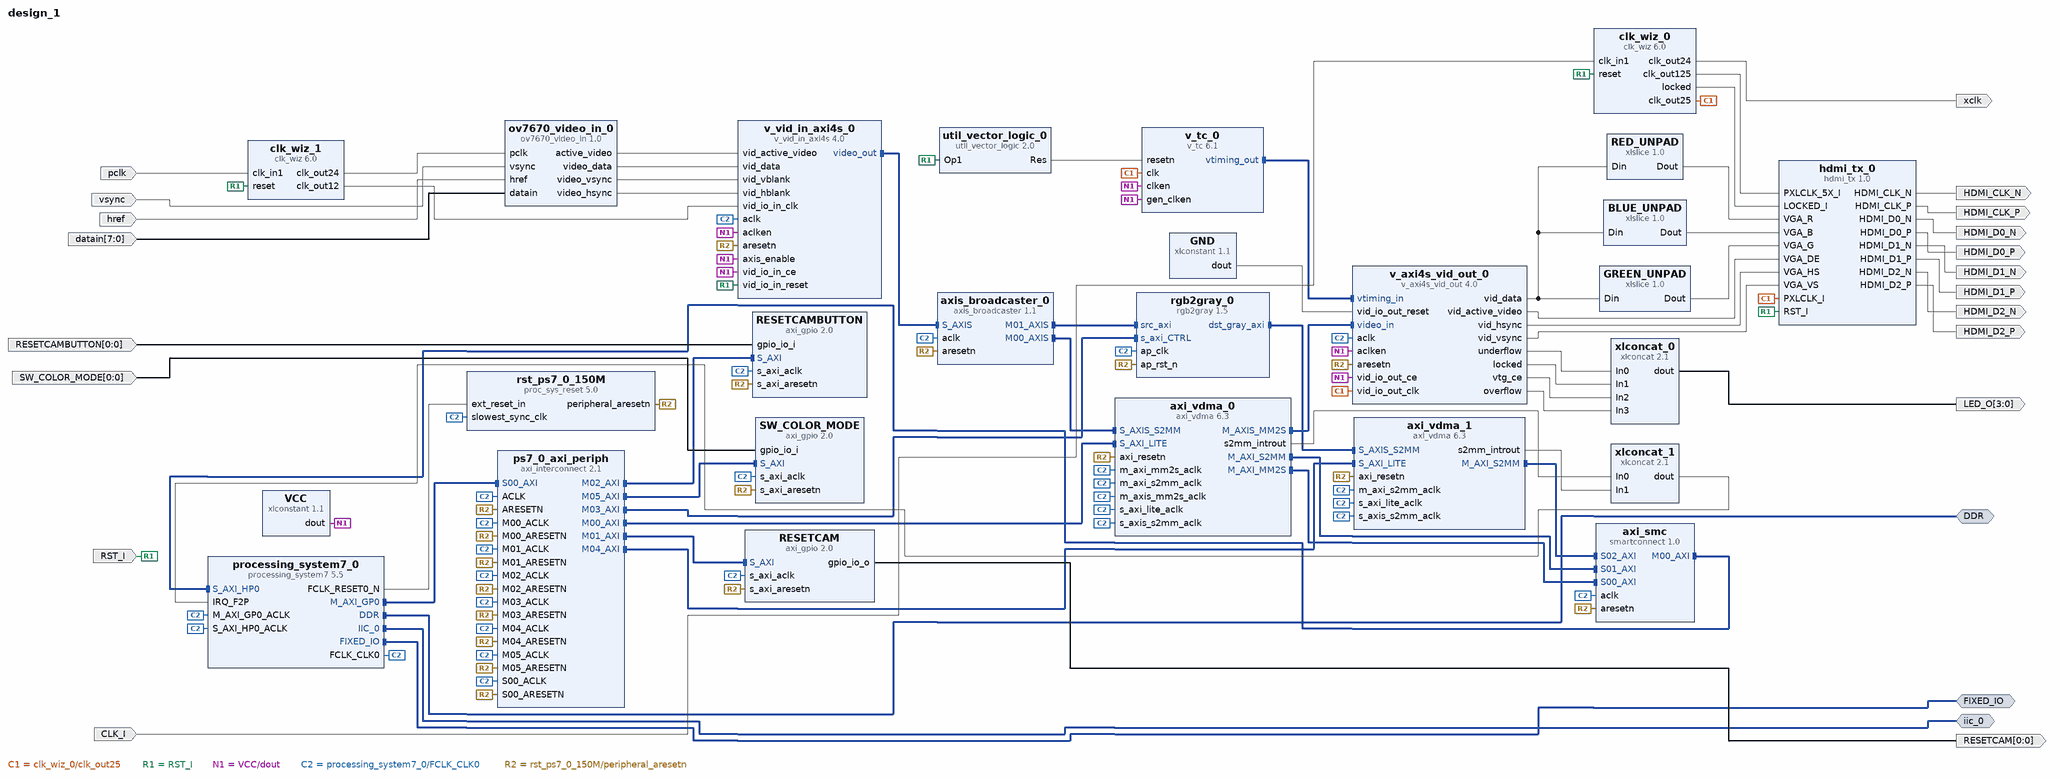
[diagram p0: block diagram of the top level]
# Vivado block design design_1, xc7z010clg400-1, Vivado 2019.1
create_bd_design design_1

create_bd_intf_port -mode Master -vlnv xilinx.com:interface:ddrx_rtl:1.0 DDR
create_bd_intf_port -mode Master -vlnv xilinx.com:display_processing_system7:fixedio_rtl:1.0 FIXED_IO
create_bd_intf_port -mode Master -vlnv xilinx.com:interface:iic_rtl:1.0 iic_0
create_bd_port -dir I -type clk CLK_I
set_property -dict {CONFIG.FREQ_HZ 125000000} [get_bd_ports CLK_I]
create_bd_port -dir I -type rst RST_I
set_property -dict {CONFIG.POLARITY ACTIVE_HIGH} [get_bd_ports RST_I]
create_bd_port -dir O HDMI_CLK_N
create_bd_port -dir O HDMI_D2_N
create_bd_port -dir O HDMI_D0_N
create_bd_port -dir O HDMI_D2_P
create_bd_port -dir O HDMI_D1_N
create_bd_port -dir O HDMI_D0_P
create_bd_port -dir O HDMI_D1_P
create_bd_port -dir O HDMI_CLK_P
create_bd_port -dir I vsync
create_bd_port -dir I href
create_bd_port -dir I -from 7 -to 0 datain
create_bd_port -dir I -type clk pclk
set_property -dict {CONFIG.FREQ_HZ 24000000} [get_bd_ports pclk]
create_bd_port -dir O -from 3 -to 0 LED_O
create_bd_port -dir O -type clk xclk
set_property -dict {CONFIG.FREQ_HZ 24038461} [get_bd_ports xclk]
create_bd_port -dir O -from 0 -to 0 RESETCAM
create_bd_port -dir I -from 0 -to 0 RESETCAMBUTTON
create_bd_port -dir I -from 0 -to 0 SW_COLOR_MODE

create_bd_cell -type ip -vlnv xilinx.com:ip:processing_system7:5.5 processing_system7_0
set_property -dict [list \
  CONFIG.PCW_APU_PERIPHERAL_FREQMHZ 666.666666 \
  CONFIG.PCW_ENET0_ENET0_IO {MIO 16 .. 27} \
  CONFIG.PCW_ENET0_GRP_MDIO_ENABLE 1 \
  CONFIG.PCW_ENET0_GRP_MDIO_IO {MIO 52 .. 53} \
  CONFIG.PCW_ENET0_PERIPHERAL_ENABLE 1 \
  CONFIG.PCW_ENET0_RESET_ENABLE 0 \
  CONFIG.PCW_ENET_RESET_ENABLE 1 \
  CONFIG.PCW_ENET_RESET_SELECT {Share reset pin} \
  CONFIG.PCW_FPGA0_PERIPHERAL_FREQMHZ 150 \
  CONFIG.PCW_GPIO_MIO_GPIO_ENABLE 1 \
  CONFIG.PCW_GPIO_MIO_GPIO_IO MIO \
  CONFIG.PCW_I2C0_I2C0_IO EMIO \
  CONFIG.PCW_I2C0_PERIPHERAL_ENABLE 1 \
  CONFIG.PCW_I2C_PERIPHERAL_FREQMHZ 111.111115 \
  CONFIG.PCW_I2C_RESET_ENABLE 1 \
  CONFIG.PCW_I2C_RESET_SELECT {Share reset pin} \
  CONFIG.PCW_IRQ_F2P_INTR 1 \
  CONFIG.PCW_PRESET_BANK1_VOLTAGE {LVCMOS 1.8V} \
  CONFIG.PCW_QSPI_GRP_FBCLK_ENABLE 1 \
  CONFIG.PCW_QSPI_GRP_FBCLK_IO {MIO 8} \
  CONFIG.PCW_QSPI_GRP_SINGLE_SS_ENABLE 1 \
  CONFIG.PCW_QSPI_GRP_SINGLE_SS_IO {MIO 1 .. 6} \
  CONFIG.PCW_QSPI_PERIPHERAL_ENABLE 1 \
  CONFIG.PCW_QSPI_QSPI_IO {MIO 1 .. 6} \
  CONFIG.PCW_SD0_GRP_CD_ENABLE 0 \
  CONFIG.PCW_SD0_GRP_WP_ENABLE 0 \
  CONFIG.PCW_SD0_PERIPHERAL_ENABLE 1 \
  CONFIG.PCW_SD0_SD0_IO {MIO 40 .. 45} \
  CONFIG.PCW_SDIO_PERIPHERAL_FREQMHZ 50 \
  CONFIG.PCW_SINGLE_QSPI_DATA_MODE x4 \
  CONFIG.PCW_UART1_PERIPHERAL_ENABLE 1 \
  CONFIG.PCW_UART1_UART1_IO {MIO 48 .. 49} \
  CONFIG.PCW_UART_PERIPHERAL_FREQMHZ 100 \
  CONFIG.PCW_UIPARAM_DDR_FREQ_MHZ 533.333333 \
  CONFIG.PCW_UIPARAM_DDR_MEMORY_TYPE {DDR 3 (Low Voltage)} \
  CONFIG.PCW_UIPARAM_DDR_PARTNO {MT41K256M16 RE-125} \
  CONFIG.PCW_USB0_PERIPHERAL_ENABLE 0 \
  CONFIG.PCW_USB_RESET_ENABLE 1 \
  CONFIG.PCW_USE_FABRIC_INTERRUPT 1 \
  CONFIG.PCW_USE_S_AXI_HP0 1 \
] [get_bd_cells processing_system7_0]
# 300 more settings of processing_system7_0 are not shown: defaults, MIO pin electricals, DDR timing, and values the tool derives
create_bd_cell -type ip -vlnv xilinx.com:ip:clk_wiz:6.0 clk_wiz_0
set_property -dict [list \
  CONFIG.CLKIN1_JITTER_PS 80.0 \
  CONFIG.CLKOUT1_JITTER 130.680 \
  CONFIG.CLKOUT1_PHASE_ERROR 122.096 \
  CONFIG.CLKOUT1_REQUESTED_OUT_FREQ 125 \
  CONFIG.CLKOUT2_JITTER 181.315 \
  CONFIG.CLKOUT2_PHASE_ERROR 122.096 \
  CONFIG.CLKOUT2_REQUESTED_OUT_FREQ 25 \
  CONFIG.CLKOUT2_USED true \
  CONFIG.CLKOUT3_JITTER 182.746 \
  CONFIG.CLKOUT3_PHASE_ERROR 122.096 \
  CONFIG.CLKOUT3_REQUESTED_OUT_FREQ 24 \
  CONFIG.CLKOUT3_USED true \
  CONFIG.CLK_OUT1_PORT clk_out125 \
  CONFIG.CLK_OUT2_PORT clk_out25 \
  CONFIG.CLK_OUT3_PORT clk_out24 \
  CONFIG.MMCM_CLKFBOUT_MULT_F 5.000 \
  CONFIG.MMCM_CLKIN1_PERIOD 8.000 \
  CONFIG.MMCM_CLKIN2_PERIOD 10.0 \
  CONFIG.MMCM_CLKOUT0_DIVIDE_F 5.000 \
  CONFIG.MMCM_CLKOUT1_DIVIDE 25 \
  CONFIG.MMCM_CLKOUT2_DIVIDE 26 \
  CONFIG.NUM_OUT_CLKS 3 \
  CONFIG.PRIM_IN_FREQ 125 \
] [get_bd_cells clk_wiz_0]
create_bd_cell -type ip -vlnv xilinx.com:ip:util_vector_logic:2.0 util_vector_logic_0
set_property -dict {CONFIG.C_OPERATION not CONFIG.C_SIZE 1} [get_bd_cells util_vector_logic_0]
create_bd_cell -type ip -vlnv digilentinc.com:digilent:hdmi_tx:1.0 hdmi_tx_0
set_property -dict {CONFIG.C_BLUE_WIDTH 5 CONFIG.C_GREEN_WIDTH 6 CONFIG.C_RED_WIDTH 5} [get_bd_cells hdmi_tx_0]
create_bd_cell -type ip -vlnv xilinx.com:ip:v_axi4s_vid_out:4.0 v_axi4s_vid_out_0
set_property -dict {CONFIG.C_ADDR_WIDTH 12 CONFIG.C_HAS_ASYNC_CLK 1 CONFIG.C_VTG_MASTER_SLAVE 1} [get_bd_cells v_axi4s_vid_out_0]
create_bd_cell -type ip -vlnv xilinx.com:ip:xlslice:1.0 GREEN_UNPAD
set_property -dict {CONFIG.DIN_FROM 15 CONFIG.DIN_TO 10 CONFIG.DIN_WIDTH 24 CONFIG.DOUT_WIDTH 6} [get_bd_cells GREEN_UNPAD]
create_bd_cell -type ip -vlnv xilinx.com:ip:xlslice:1.0 RED_UNPAD
set_property -dict {CONFIG.DIN_FROM 23 CONFIG.DIN_TO 19 CONFIG.DIN_WIDTH 24 CONFIG.DOUT_WIDTH 5} [get_bd_cells RED_UNPAD]
create_bd_cell -type ip -vlnv xilinx.com:ip:xlslice:1.0 BLUE_UNPAD
set_property -dict {CONFIG.DIN_FROM 7 CONFIG.DIN_TO 3 CONFIG.DIN_WIDTH 24 CONFIG.DOUT_WIDTH 5} [get_bd_cells BLUE_UNPAD]
create_bd_cell -type ip -vlnv xilinx.com:ip:v_tc:6.1 v_tc_0
set_property -dict {CONFIG.HAS_AXI4_LITE false CONFIG.VIDEO_MODE 640x480p CONFIG.enable_detection false} [get_bd_cells v_tc_0]
create_bd_cell -type ip -vlnv xilinx.com:ip:xlconstant:1.1 GND
set_property -dict {CONFIG.CONST_VAL 0} [get_bd_cells GND]
create_bd_cell -type ip -vlnv xilinx.com:ip:xlconstant:1.1 VCC
create_bd_cell -type ip -vlnv xilinx.com:ip:axi_vdma:6.3 axi_vdma_0
set_property -dict {CONFIG.c_m_axis_mm2s_tdata_width 24 CONFIG.c_num_fstores 4} [get_bd_cells axi_vdma_0]
create_bd_cell -type ip -vlnv xilinx.com:ip:axi_interconnect:2.1 ps7_0_axi_periph
set_property -dict {CONFIG.NUM_MI 6} [get_bd_cells ps7_0_axi_periph]
create_bd_cell -type ip -vlnv xilinx.com:ip:proc_sys_reset:5.0 rst_ps7_0_150M
create_bd_cell -type ip -vlnv xilinx.com:ip:smartconnect:1.0 axi_smc
set_property -dict {CONFIG.NUM_SI 3} [get_bd_cells axi_smc]
create_bd_cell -type ip -vlnv xilinx.com:ip:v_vid_in_axi4s:4.0 v_vid_in_axi4s_0
set_property -dict {CONFIG.C_HAS_ASYNC_CLK 1} [get_bd_cells v_vid_in_axi4s_0]
create_bd_cell -type ip -vlnv xilinx.com:user:ov7670_video_in:1.0 ov7670_video_in_0
create_bd_cell -type ip -vlnv xilinx.com:ip:clk_wiz:6.0 clk_wiz_1
set_property -dict [list \
  CONFIG.CLKIN1_JITTER_PS 416.65999999999997 \
  CONFIG.CLKOUT1_JITTER 367.252 \
  CONFIG.CLKOUT1_PHASE_ERROR 244.470 \
  CONFIG.CLKOUT1_REQUESTED_OUT_FREQ 24 \
  CONFIG.CLKOUT2_JITTER 421.167 \
  CONFIG.CLKOUT2_PHASE_ERROR 244.470 \
  CONFIG.CLKOUT2_REQUESTED_OUT_FREQ 12 \
  CONFIG.CLKOUT2_USED true \
  CONFIG.CLK_OUT1_PORT clk_out24 \
  CONFIG.CLK_OUT2_PORT clk_out12 \
  CONFIG.MMCM_CLKFBOUT_MULT_F 41.500 \
  CONFIG.MMCM_CLKIN1_PERIOD 41.667 \
  CONFIG.MMCM_CLKIN2_PERIOD 10.0 \
  CONFIG.MMCM_CLKOUT0_DIVIDE_F 41.500 \
  CONFIG.MMCM_CLKOUT1_DIVIDE 83 \
  CONFIG.NUM_OUT_CLKS 2 \
  CONFIG.PRIM_IN_FREQ 24 \
] [get_bd_cells clk_wiz_1]
create_bd_cell -type ip -vlnv xilinx.com:ip:xlconcat:2.1 xlconcat_0
set_property -dict {CONFIG.NUM_PORTS 4} [get_bd_cells xlconcat_0]
create_bd_cell -type ip -vlnv xilinx.com:ip:axi_gpio:2.0 RESETCAM
set_property -dict {CONFIG.C_ALL_OUTPUTS 1 CONFIG.C_GPIO_WIDTH 1} [get_bd_cells RESETCAM]
create_bd_cell -type ip -vlnv xilinx.com:ip:axi_gpio:2.0 RESETCAMBUTTON
set_property -dict {CONFIG.C_ALL_INPUTS 1 CONFIG.C_GPIO_WIDTH 1} [get_bd_cells RESETCAMBUTTON]
create_bd_cell -type ip -vlnv xilinx.com:ip:axi_vdma:6.3 axi_vdma_1
set_property -dict {CONFIG.c_include_mm2s 0} [get_bd_cells axi_vdma_1]
create_bd_cell -type ip -vlnv xilinx.com:ip:xlconcat:2.1 xlconcat_1
create_bd_cell -type ip -vlnv xilinx.com:ip:axi_gpio:2.0 SW_COLOR_MODE
set_property -dict {CONFIG.C_ALL_INPUTS 1 CONFIG.C_GPIO_WIDTH 1} [get_bd_cells SW_COLOR_MODE]
create_bd_cell -type ip -vlnv xilinx.com:hls:rgb2gray:1.5 rgb2gray_0
create_bd_cell -type ip -vlnv xilinx.com:ip:axis_broadcaster:1.1 axis_broadcaster_0

# ---- connections ----

connect_bd_intf_net [get_bd_intf_pins axi_smc/M00_AXI] [get_bd_intf_pins processing_system7_0/S_AXI_HP0]
connect_bd_intf_net [get_bd_intf_pins ps7_0_axi_periph/M04_AXI] [get_bd_intf_pins axi_vdma_1/S_AXI_LITE]
connect_bd_intf_net [get_bd_intf_pins processing_system7_0/M_AXI_GP0] [get_bd_intf_pins ps7_0_axi_periph/S00_AXI]
connect_bd_intf_net [get_bd_intf_pins axi_vdma_0/M_AXI_S2MM] [get_bd_intf_pins axi_smc/S01_AXI]
connect_bd_intf_net [get_bd_intf_pins rgb2gray_0/dst_gray_axi] [get_bd_intf_pins axi_vdma_1/S_AXIS_S2MM]
connect_bd_intf_net [get_bd_intf_pins axis_broadcaster_0/M00_AXIS] [get_bd_intf_pins axi_vdma_0/S_AXIS_S2MM]
connect_bd_intf_net [get_bd_intf_pins ps7_0_axi_periph/M03_AXI] [get_bd_intf_pins rgb2gray_0/s_axi_CTRL]
connect_bd_intf_net [get_bd_intf_pins axis_broadcaster_0/M01_AXIS] [get_bd_intf_pins rgb2gray_0/src_axi]
connect_bd_intf_net [get_bd_intf_pins ps7_0_axi_periph/M02_AXI] [get_bd_intf_pins RESETCAMBUTTON/S_AXI]
connect_bd_intf_net [get_bd_intf_pins ps7_0_axi_periph/M05_AXI] [get_bd_intf_pins SW_COLOR_MODE/S_AXI]
connect_bd_intf_net [get_bd_intf_ports iic_0] [get_bd_intf_pins processing_system7_0/IIC_0]
connect_bd_intf_net [get_bd_intf_pins v_tc_0/vtiming_out] [get_bd_intf_pins v_axi4s_vid_out_0/vtiming_in]
connect_bd_intf_net [get_bd_intf_pins v_vid_in_axi4s_0/video_out] [get_bd_intf_pins axis_broadcaster_0/S_AXIS]
connect_bd_intf_net [get_bd_intf_pins axi_vdma_1/M_AXI_S2MM] [get_bd_intf_pins axi_smc/S02_AXI]
connect_bd_intf_net [get_bd_intf_ports DDR] [get_bd_intf_pins processing_system7_0/DDR]
connect_bd_intf_net [get_bd_intf_pins axi_vdma_0/M_AXIS_MM2S] [get_bd_intf_pins v_axi4s_vid_out_0/video_in]
connect_bd_intf_net [get_bd_intf_pins ps7_0_axi_periph/M00_AXI] [get_bd_intf_pins axi_vdma_0/S_AXI_LITE]
connect_bd_intf_net [get_bd_intf_ports FIXED_IO] [get_bd_intf_pins processing_system7_0/FIXED_IO]
connect_bd_intf_net [get_bd_intf_pins ps7_0_axi_periph/M01_AXI] [get_bd_intf_pins RESETCAM/S_AXI]
connect_bd_intf_net [get_bd_intf_pins axi_vdma_0/M_AXI_MM2S] [get_bd_intf_pins axi_smc/S00_AXI]
connect_bd_net -net clk_in1_0_1 [get_bd_ports CLK_I] [get_bd_pins clk_wiz_0/clk_in1]
connect_bd_net [get_bd_pins hdmi_tx_0/HDMI_CLK_N] [get_bd_ports HDMI_CLK_N]
connect_bd_net [get_bd_pins hdmi_tx_0/HDMI_D2_N] [get_bd_ports HDMI_D2_N]
connect_bd_net [get_bd_pins hdmi_tx_0/HDMI_D0_N] [get_bd_ports HDMI_D0_N]
connect_bd_net [get_bd_pins hdmi_tx_0/HDMI_D2_P] [get_bd_ports HDMI_D2_P]
connect_bd_net [get_bd_pins hdmi_tx_0/HDMI_D1_N] [get_bd_ports HDMI_D1_N]
connect_bd_net [get_bd_pins hdmi_tx_0/HDMI_D0_P] [get_bd_ports HDMI_D0_P]
connect_bd_net [get_bd_pins hdmi_tx_0/HDMI_D1_P] [get_bd_ports HDMI_D1_P]
connect_bd_net [get_bd_pins hdmi_tx_0/HDMI_CLK_P] [get_bd_ports HDMI_CLK_P]
connect_bd_net [get_bd_pins clk_wiz_0/clk_out25] \
  [get_bd_pins hdmi_tx_0/PXLCLK_I] [get_bd_pins v_tc_0/clk] [get_bd_pins v_axi4s_vid_out_0/vid_io_out_clk]
connect_bd_net [get_bd_pins clk_wiz_0/clk_out125] [get_bd_pins hdmi_tx_0/PXLCLK_5X_I]
connect_bd_net [get_bd_pins clk_wiz_0/locked] [get_bd_pins hdmi_tx_0/LOCKED_I]
connect_bd_net -net reset_0_1 [get_bd_ports RST_I] \
  [get_bd_pins clk_wiz_0/reset] [get_bd_pins util_vector_logic_0/Op1] [get_bd_pins hdmi_tx_0/RST_I] \
  [get_bd_pins clk_wiz_1/reset] [get_bd_pins v_vid_in_axi4s_0/vid_io_in_reset]
connect_bd_net [get_bd_pins v_axi4s_vid_out_0/vid_active_video] [get_bd_pins hdmi_tx_0/VGA_DE]
connect_bd_net [get_bd_pins v_axi4s_vid_out_0/vid_hsync] [get_bd_pins hdmi_tx_0/VGA_HS]
connect_bd_net [get_bd_pins v_axi4s_vid_out_0/vid_vsync] [get_bd_pins hdmi_tx_0/VGA_VS]
connect_bd_net [get_bd_pins v_axi4s_vid_out_0/vid_data] [get_bd_pins BLUE_UNPAD/Din] [get_bd_pins GREEN_UNPAD/Din] [get_bd_pins RED_UNPAD/Din]
connect_bd_net [get_bd_pins RED_UNPAD/Dout] [get_bd_pins hdmi_tx_0/VGA_R]
connect_bd_net [get_bd_pins GREEN_UNPAD/Dout] [get_bd_pins hdmi_tx_0/VGA_G]
connect_bd_net [get_bd_pins BLUE_UNPAD/Dout] [get_bd_pins hdmi_tx_0/VGA_B]
connect_bd_net [get_bd_pins VCC/dout] \
  [get_bd_pins v_tc_0/clken] [get_bd_pins v_tc_0/gen_clken] [get_bd_pins v_vid_in_axi4s_0/vid_io_in_ce] \
  [get_bd_pins v_vid_in_axi4s_0/aclken] [get_bd_pins v_vid_in_axi4s_0/axis_enable] [get_bd_pins v_axi4s_vid_out_0/aclken] \
  [get_bd_pins v_axi4s_vid_out_0/vid_io_out_ce]
connect_bd_net [get_bd_pins util_vector_logic_0/Res] [get_bd_pins v_tc_0/resetn]
connect_bd_net [get_bd_pins processing_system7_0/FCLK_CLK0] \
  [get_bd_pins processing_system7_0/M_AXI_GP0_ACLK] [get_bd_pins ps7_0_axi_periph/S00_ACLK] \
  [get_bd_pins rst_ps7_0_150M/slowest_sync_clk] [get_bd_pins axi_vdma_0/s_axi_lite_aclk] \
  [get_bd_pins ps7_0_axi_periph/M00_ACLK] [get_bd_pins ps7_0_axi_periph/ACLK] [get_bd_pins axi_vdma_0/m_axi_mm2s_aclk] \
  [get_bd_pins axi_smc/aclk] [get_bd_pins processing_system7_0/S_AXI_HP0_ACLK] [get_bd_pins axi_vdma_0/m_axi_s2mm_aclk] \
  [get_bd_pins axi_vdma_0/m_axis_mm2s_aclk] [get_bd_pins axi_vdma_0/s_axis_s2mm_aclk] [get_bd_pins v_vid_in_axi4s_0/aclk] \
  [get_bd_pins v_axi4s_vid_out_0/aclk] [get_bd_pins RESETCAM/s_axi_aclk] [get_bd_pins ps7_0_axi_periph/M01_ACLK] \
  [get_bd_pins RESETCAMBUTTON/s_axi_aclk] [get_bd_pins ps7_0_axi_periph/M02_ACLK] [get_bd_pins ps7_0_axi_periph/M03_ACLK] \
  [get_bd_pins axi_vdma_1/s_axi_lite_aclk] [get_bd_pins ps7_0_axi_periph/M04_ACLK] [get_bd_pins axi_vdma_1/m_axi_s2mm_aclk] \
  [get_bd_pins axi_vdma_1/s_axis_s2mm_aclk] [get_bd_pins SW_COLOR_MODE/s_axi_aclk] [get_bd_pins ps7_0_axi_periph/M05_ACLK] \
  [get_bd_pins rgb2gray_0/ap_clk] [get_bd_pins axis_broadcaster_0/aclk]
connect_bd_net [get_bd_pins processing_system7_0/FCLK_RESET0_N] [get_bd_pins rst_ps7_0_150M/ext_reset_in]
connect_bd_net [get_bd_pins rst_ps7_0_150M/peripheral_aresetn] \
  [get_bd_pins ps7_0_axi_periph/S00_ARESETN] [get_bd_pins axi_vdma_0/axi_resetn] [get_bd_pins ps7_0_axi_periph/M00_ARESETN] \
  [get_bd_pins ps7_0_axi_periph/ARESETN] [get_bd_pins axi_smc/aresetn] [get_bd_pins v_vid_in_axi4s_0/aresetn] \
  [get_bd_pins v_axi4s_vid_out_0/aresetn] [get_bd_pins RESETCAM/s_axi_aresetn] [get_bd_pins ps7_0_axi_periph/M01_ARESETN] \
  [get_bd_pins RESETCAMBUTTON/s_axi_aresetn] [get_bd_pins ps7_0_axi_periph/M02_ARESETN] \
  [get_bd_pins ps7_0_axi_periph/M03_ARESETN] [get_bd_pins axi_vdma_1/axi_resetn] [get_bd_pins ps7_0_axi_periph/M04_ARESETN] \
  [get_bd_pins SW_COLOR_MODE/s_axi_aresetn] [get_bd_pins ps7_0_axi_periph/M05_ARESETN] [get_bd_pins rgb2gray_0/ap_rst_n] \
  [get_bd_pins axis_broadcaster_0/aresetn]
connect_bd_net -net vsync_0_1 [get_bd_ports vsync] [get_bd_pins ov7670_video_in_0/vsync]
connect_bd_net -net href_0_1 [get_bd_ports href] [get_bd_pins ov7670_video_in_0/href]
connect_bd_net -net datain_0_1 [get_bd_ports datain] [get_bd_pins ov7670_video_in_0/datain]
connect_bd_net [get_bd_pins ov7670_video_in_0/active_video] [get_bd_pins v_vid_in_axi4s_0/vid_active_video]
connect_bd_net [get_bd_pins ov7670_video_in_0/video_data] [get_bd_pins v_vid_in_axi4s_0/vid_data]
connect_bd_net -net clk_in1_0_2 [get_bd_ports pclk] [get_bd_pins clk_wiz_1/clk_in1]
connect_bd_net [get_bd_pins clk_wiz_1/clk_out24] [get_bd_pins ov7670_video_in_0/pclk]
connect_bd_net [get_bd_pins clk_wiz_1/clk_out12] [get_bd_pins v_vid_in_axi4s_0/vid_io_in_clk]
connect_bd_net [get_bd_pins GND/dout] [get_bd_pins v_axi4s_vid_out_0/vid_io_out_reset]
connect_bd_net [get_bd_pins v_axi4s_vid_out_0/underflow] [get_bd_pins xlconcat_0/In0]
connect_bd_net [get_bd_pins v_axi4s_vid_out_0/locked] [get_bd_pins xlconcat_0/In1]
connect_bd_net [get_bd_pins v_axi4s_vid_out_0/vtg_ce] [get_bd_pins xlconcat_0/In2]
connect_bd_net [get_bd_pins v_axi4s_vid_out_0/overflow] [get_bd_pins xlconcat_0/In3]
connect_bd_net [get_bd_pins xlconcat_0/dout] [get_bd_ports LED_O]
connect_bd_net [get_bd_pins clk_wiz_0/clk_out24] [get_bd_ports xclk]
connect_bd_net [get_bd_pins RESETCAM/gpio_io_o] [get_bd_ports RESETCAM]
connect_bd_net -net gpio_io_i_0_1 [get_bd_ports RESETCAMBUTTON] [get_bd_pins RESETCAMBUTTON/gpio_io_i]
connect_bd_net [get_bd_pins ov7670_video_in_0/video_vsync] [get_bd_pins v_vid_in_axi4s_0/vid_vblank]
connect_bd_net [get_bd_pins ov7670_video_in_0/video_hsync] [get_bd_pins v_vid_in_axi4s_0/vid_hblank]
connect_bd_net [get_bd_pins axi_vdma_0/s2mm_introut] [get_bd_pins xlconcat_1/In0]
connect_bd_net [get_bd_pins axi_vdma_1/s2mm_introut] [get_bd_pins xlconcat_1/In1]
connect_bd_net [get_bd_pins xlconcat_1/dout] [get_bd_pins processing_system7_0/IRQ_F2P]
connect_bd_net -net gpio_io_i_0_2 [get_bd_ports SW_COLOR_MODE] [get_bd_pins SW_COLOR_MODE/gpio_io_i]

# ---- address map ----
assign_bd_address -offset 0x00000000 -range 1G -target_address_space [get_bd_addr_spaces axi_vdma_0/Data_MM2S] [get_bd_addr_segs processing_system7_0/S_AXI_HP0/HP0_DDR_LOWOCM]
assign_bd_address -offset 0x00000000 -range 1G -target_address_space [get_bd_addr_spaces axi_vdma_0/Data_S2MM] [get_bd_addr_segs processing_system7_0/S_AXI_HP0/HP0_DDR_LOWOCM]
assign_bd_address -offset 0x00000000 -range 1G -target_address_space [get_bd_addr_spaces axi_vdma_1/Data_S2MM] [get_bd_addr_segs processing_system7_0/S_AXI_HP0/HP0_DDR_LOWOCM]
assign_bd_address -offset 0x41200000 -range 64K -target_address_space [get_bd_addr_spaces processing_system7_0/Data] [get_bd_addr_segs RESETCAM/S_AXI/Reg]
assign_bd_address -offset 0x41210000 -range 64K -target_address_space [get_bd_addr_spaces processing_system7_0/Data] [get_bd_addr_segs RESETCAMBUTTON/S_AXI/Reg]
assign_bd_address -offset 0x41220000 -range 64K -target_address_space [get_bd_addr_spaces processing_system7_0/Data] [get_bd_addr_segs SW_COLOR_MODE/S_AXI/Reg]
assign_bd_address -offset 0x43000000 -range 64K -target_address_space [get_bd_addr_spaces processing_system7_0/Data] [get_bd_addr_segs axi_vdma_0/S_AXI_LITE/Reg]
assign_bd_address -offset 0x43010000 -range 64K -target_address_space [get_bd_addr_spaces processing_system7_0/Data] [get_bd_addr_segs axi_vdma_1/S_AXI_LITE/Reg]
assign_bd_address -offset 0x43C00000 -range 64K -target_address_space [get_bd_addr_spaces processing_system7_0/Data] [get_bd_addr_segs rgb2gray_0/s_axi_CTRL/Reg]

validate_bd_design
save_bd_design
